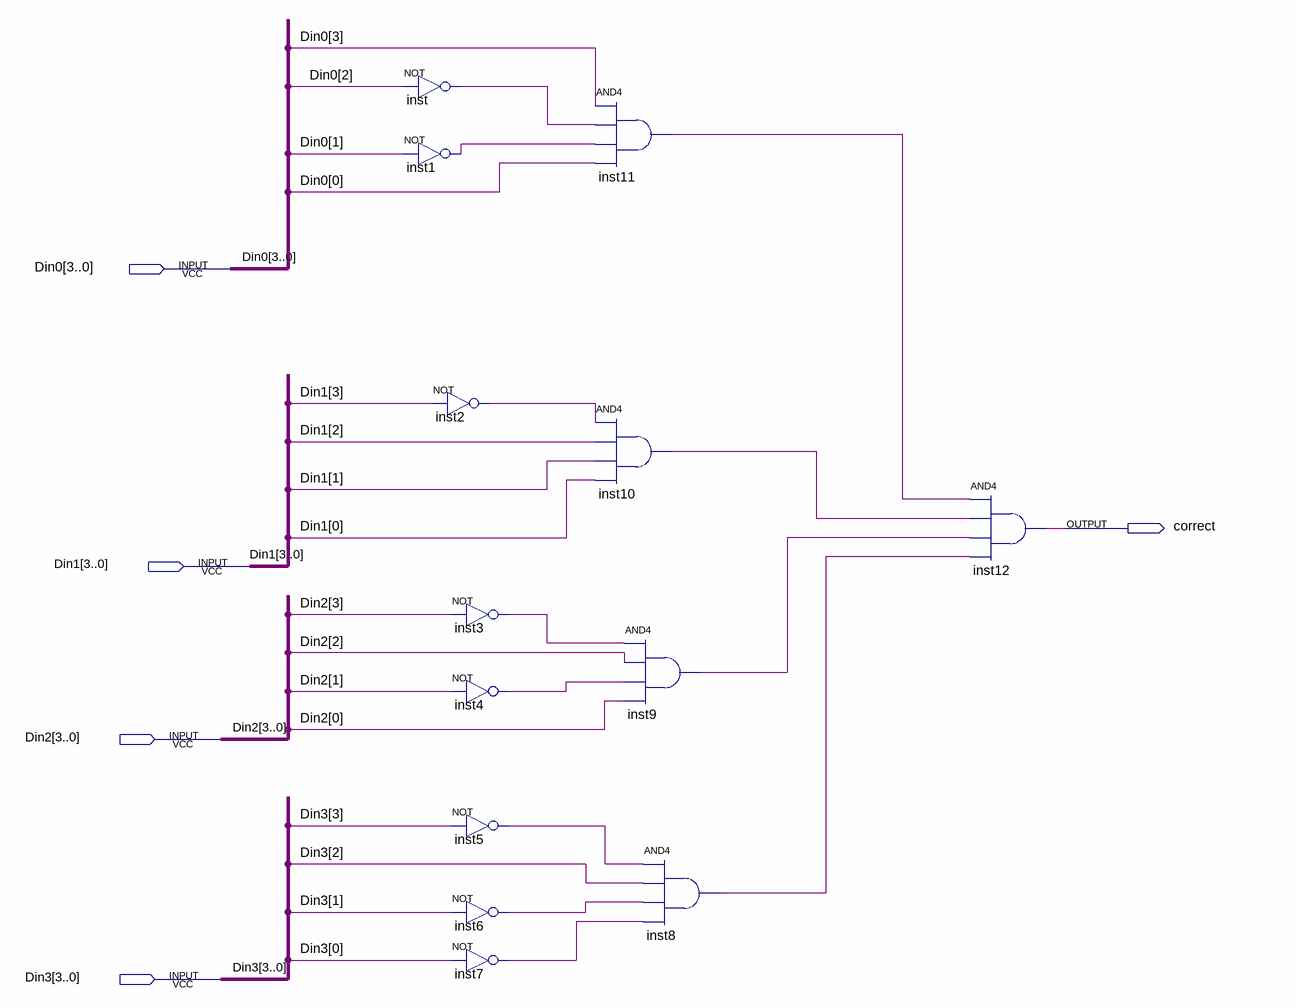
[diagram p0: schematic sheet]
// Quartus schematic is_correct.bdf as structural Verilog: 13 symbols, 5 pins
module is_correct (
  input  [3:0] Din0,
  input  [3:0] Din1,
  input  [3:0] Din2,
  input  [3:0] Din3,
  output correct
);

  wire inst1_out, inst2_out, inst3_out, inst4_out, inst5_out, inst6_out, inst7_out, inst8_out, inst9_out,
       inst10_out, inst11_out, inst_out;

  not inst (inst_out, Din0[2]);
  not inst1 (inst1_out, Din0[1]);
  not inst2 (inst2_out, Din1[3]);
  not inst3 (inst3_out, Din2[3]);
  not inst4 (inst4_out, Din2[1]);
  not inst5 (inst5_out, Din3[3]);
  not inst6 (inst6_out, Din3[1]);
  not inst7 (inst7_out, Din3[0]);
  and inst11 (inst11_out, Din0[3], inst_out, inst1_out, Din0[0]);
  and inst10 (inst10_out, inst2_out, Din1[2], Din1[1], Din1[0]);
  and inst9 (inst9_out, inst3_out, Din2[2], inst4_out, Din2[0]);
  and inst8 (inst8_out, inst5_out, Din3[2], inst6_out, inst7_out);
  and inst12 (correct, inst11_out, inst10_out, inst9_out, inst8_out);
endmodule
